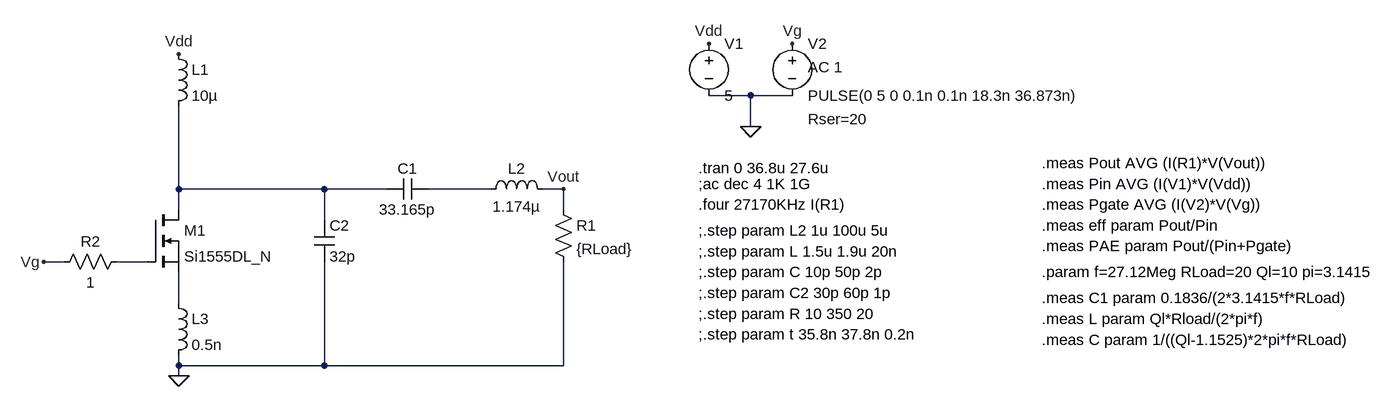
[diagram p0: schematic ClassE_MOS.asc]
ClassE_MOS.asc, the LTspice schematic file:
Version 4
SHEET 1 1444 680
WIRE 192 -336 128 -336
WIRE 256 -336 192 -336
WIRE 192 -288 192 -336
WIRE -688 -192 -688 -320
WIRE -464 -192 -688 -192
WIRE -368 -192 -464 -192
WIRE -208 -192 -304 -192
WIRE -96 -192 -128 -192
WIRE -688 -160 -688 -192
WIRE -96 -160 -96 -192
WIRE -464 -144 -464 -192
WIRE -864 -80 -896 -80
WIRE -736 -80 -784 -80
WIRE -688 -16 -688 -64
WIRE -688 80 -688 64
WIRE -464 80 -464 -80
WIRE -464 80 -688 80
WIRE -96 80 -96 -80
WIRE -96 80 -464 80
WIRE -688 96 -688 80
FLAG -688 -400 Vdd
FLAG -896 -80 Vg
FLAG 192 -288 0
FLAG 128 -416 Vdd
FLAG 256 -416 Vg
FLAG -96 -192 Vout
FLAG -688 96 0
SYMBOL ind -704 -416 R0
SYMATTR InstName L1
SYMATTR Value 10µ
SYMATTR SpiceLine Rser=0.1
SYMBOL ind -224 -176 R270
WINDOW 0 32 56 VTop 2
WINDOW 3 5 56 VBottom 2
SYMATTR InstName L2
SYMATTR Value 1.174µ
SYMATTR SpiceLine Rser=0.1
SYMBOL cap -304 -208 R90
WINDOW 0 0 32 VBottom 2
WINDOW 3 32 32 VTop 2
SYMATTR InstName C1
SYMATTR Value 33.165p
SYMATTR SpiceLine Rser=0.1
SYMBOL res -112 -176 R0
SYMATTR InstName R1
SYMATTR Value {RLoad}
SYMBOL voltage 128 -432 R0
WINDOW 123 0 0 Left 0
WINDOW 39 0 0 Left 0
SYMATTR InstName V1
SYMATTR Value 5
SYMBOL voltage 256 -432 R0
WINDOW 123 24 52 Left 2
WINDOW 39 24 132 Left 2
SYMATTR Value2 AC 1
SYMATTR SpiceLine Rser=20
SYMATTR InstName V2
SYMATTR Value PULSE(0 5 0 0.1n 0.1n 18.3n 36.873n)
SYMBOL cap -480 -144 R0
SYMATTR InstName C2
SYMATTR Value 32p
SYMATTR SpiceLine Rser=0.1
SYMBOL ind -704 -32 R0
SYMATTR InstName L3
SYMATTR Value 0.5n
SYMATTR SpiceLine Rser=10m
SYMBOL res -768 -96 R90
WINDOW 0 0 56 VBottom 2
WINDOW 3 32 56 VTop 2
SYMATTR InstName R2
SYMATTR Value 1
SYMBOL nmos -736 -160 R0
SYMATTR InstName M1
SYMATTR Value Si1555DL_N
TEXT 112 -224 Left 2 !.tran 0 36.8u 27.6u
TEXT 112 -200 Left 2 !;ac dec 4 1K 1G
TEXT 112 -96 Left 2 !;.step param L 1.5u 1.9u 20n
TEXT 640 -232 Left 2 !.meas Pout AVG (I(R1)*V(Vout))
TEXT 640 -200 Left 2 !.meas Pin AVG (I(V1)*V(Vdd))
TEXT 640 -136 Left 2 !.meas eff param Pout/Pin
TEXT 112 -168 Left 2 !.four 27170KHz I(R1)
TEXT 112 0 Left 2 !;.step param R 10 350 20
TEXT 112 -128 Left 2 !;.step param L2 1u 100u 5u
TEXT 112 -64 Left 2 !;.step param C 10p 50p 2p
TEXT 112 -32 Left 2 !;.step param C2 30p 60p 1p
TEXT 112 32 Left 2 !;.step param t 35.8n 37.8n 0.2n
TEXT 640 -64 Left 2 !.param f=27.12Meg RLoad=20 Ql=10 pi=3.1415
TEXT 640 -168 Left 2 !.meas Pgate AVG (I(V2)*V(Vg))
TEXT 640 -104 Left 2 !.meas PAE param Pout/(Pin+Pgate)
TEXT 640 -24 Left 2 !.meas C1 param 0.1836/(2*3.1415*f*RLoad)
TEXT 640 8 Left 2 !.meas L param Ql*Rload/(2*pi*f)
TEXT 640 40 Left 2 !.meas C param 1/((Ql-1.1525)*2*pi*f*RLoad)

The netlist it stands for:
* ClassE_MOS.asc
L1 Vdd N001 10µ Rser=0.1
L2 N002 Vout 1.174µ Rser=0.1
C1 N002 N001 33.165p Rser=0.1
R1 Vout 0 {RLoad}
V1 Vdd 0 5
V2 Vg 0 PULSE(0 5 0 0.1n 0.1n 18.3n 36.873n) AC 1 Rser=20
C2 N001 0 32p Rser=0.1
L3 N004 0 0.5n Rser=10m
R2 N003 Vg 1
M1 N001 N003 N004 N004 Si1555DL_N
.model NMOS NMOS
.model PMOS PMOS
.lib standard.mos
.tran 0 36.8u 27.6u
;ac dec 4 1K 1G
;.step param L 1.5u 1.9u 20n
.meas Pout AVG (I(R1)*V(Vout))
.meas Pin AVG (I(V1)*V(Vdd))
.meas eff param Pout/Pin
.four 27170KHz I(R1)
;.step param R 10 350 20
;.step param L2 1u 100u 5u
;.step param C 10p 50p 2p
;.step param C2 30p 60p 1p
;.step param t 35.8n 37.8n 0.2n
.param f=27.12Meg RLoad=20 Ql=10 pi=3.1415
.meas Pgate AVG (I(V2)*V(Vg))
.meas PAE param Pout/(Pin+Pgate)
.meas C1 param 0.1836/(2*3.1415*f*RLoad)
.meas L param Ql*Rload/(2*pi*f)
.meas C param 1/((Ql-1.1525)*2*pi*f*RLoad)
.backanno
.end